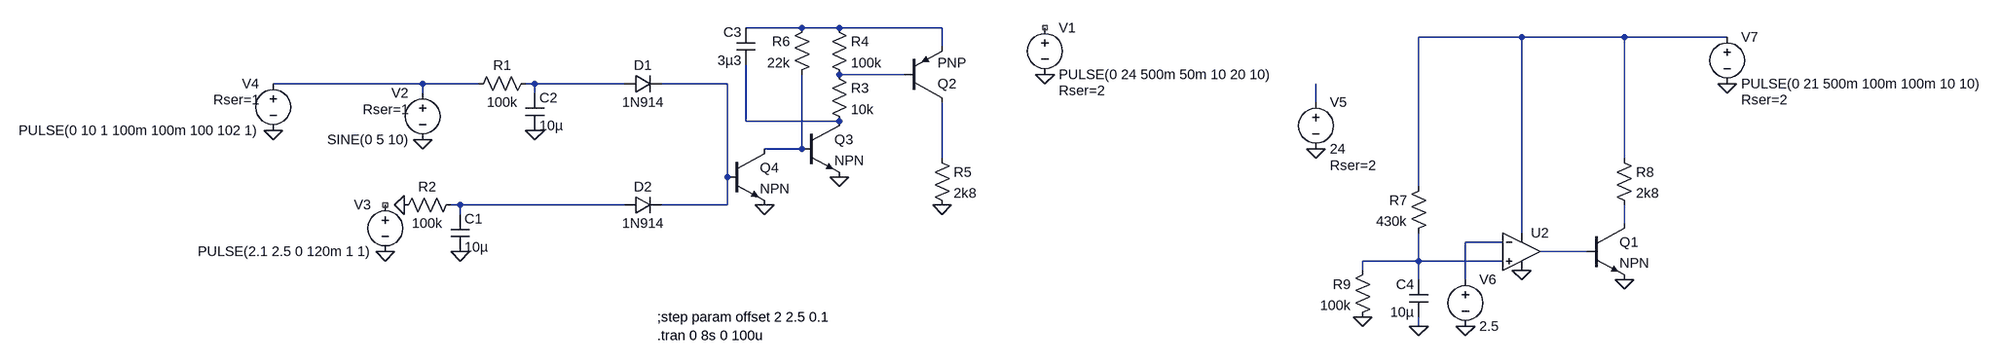
[diagram p0: schematic DC_detection_3.asc]
DC_detection_3.asc, the LTspice schematic file:
Version 4
SHEET 1 2336 680
WIRE 288 -208 192 -208
WIRE 352 -208 288 -208
WIRE 528 -208 352 -208
WIRE 1520 -192 1344 -192
WIRE 1696 -192 1520 -192
WIRE 1872 -192 1696 -192
WIRE 528 -176 528 -208
WIRE 464 -128 352 -128
WIRE -368 -112 -624 -112
WIRE -272 -112 -368 -112
WIRE -176 -112 -192 -112
WIRE -16 -112 -176 -112
WIRE 160 -112 48 -112
WIRE -368 -96 -368 -112
WIRE -176 -96 -176 -112
WIRE 1168 -80 1168 -112
WIRE 192 -48 192 -144
WIRE 352 -48 192 -48
WIRE 288 0 288 -128
WIRE 288 0 224 0
WIRE 528 16 528 -80
WIRE 1696 16 1696 -192
WIRE 160 48 160 -112
WIRE 1344 64 1344 -192
WIRE -304 96 -320 96
WIRE -16 96 -304 96
WIRE 160 96 160 48
WIRE 160 96 48 96
WIRE -304 112 -304 96
WIRE 1696 128 1696 96
WIRE 1520 144 1520 -192
WIRE 1488 160 1424 160
WIRE 1632 176 1552 176
WIRE 1344 192 1344 144
WIRE 1344 192 1248 192
WIRE 1488 192 1344 192
WIRE 1248 208 1248 192
WIRE 1344 224 1344 192
WIRE 1424 224 1424 160
WIRE 1344 304 1344 288
FLAG -176 -32 0
FLAG -304 176 0
FLAG -432 176 0
FLAG -368 -16 0
FLAG 704 -128 0
FLAG 528 96 0
FLAG 224 96 0
FLAG 352 48 0
FLAG -400 96 0
FLAG -624 -32 0
FLAG 1344 304 0
FLAG 1520 208 0
FLAG 1696 224 0
FLAG 1424 304 0
FLAG 1248 288 0
FLAG 1872 -112 0
FLAG 1168 0 0
SYMBOL res -176 -128 R90
WINDOW 0 0 56 VBottom 2
WINDOW 3 32 56 VTop 2
SYMATTR InstName R1
SYMATTR Value 100k
SYMBOL res -304 80 R90
WINDOW 0 0 56 VBottom 2
WINDOW 3 32 56 VTop 2
SYMATTR InstName R2
SYMATTR Value 100k
SYMBOL cap -320 112 R0
SYMATTR InstName C1
SYMATTR Value 10µ
SYMBOL cap -192 -96 R0
SYMATTR InstName C2
SYMATTR Value 10µ
SYMBOL pnp 464 -80 M180
SYMATTR InstName Q2
SYMBOL res 336 -144 R0
SYMATTR InstName R3
SYMATTR Value 10k
SYMBOL res 336 -224 R0
SYMATTR InstName R4
SYMATTR Value 100k
SYMBOL voltage 704 -224 R0
WINDOW 123 0 0 Left 0
WINDOW 39 24 124 Left 2
SYMATTR SpiceLine Rser=2
SYMATTR InstName V1
SYMATTR Value PULSE(0 24 500m 50m 10 20 10)
SYMBOL voltage -368 -112 M0
WINDOW 123 0 0 Left 0
WINDOW 39 24 44 Left 2
SYMATTR SpiceLine Rser=1
SYMATTR InstName V2
SYMATTR Value SINE(0 5 10)
SYMBOL voltage -432 80 M0
WINDOW 123 0 0 Left 0
WINDOW 39 0 0 Left 0
SYMATTR InstName V3
SYMATTR Value PULSE(2.1 2.5 0 120m 1 1)
SYMBOL npn 288 -48 R0
SYMATTR InstName Q3
SYMBOL res 512 0 R0
SYMATTR InstName R5
SYMATTR Value 2k8
SYMBOL res 304 -224 M0
SYMATTR InstName R6
SYMATTR Value 22k
SYMBOL npn 160 0 R0
SYMATTR InstName Q4
SYMBOL diode -16 -96 R270
WINDOW 0 32 32 VTop 2
WINDOW 3 0 32 VBottom 2
SYMATTR InstName D1
SYMATTR Value 1N914
SYMBOL diode -16 112 R270
WINDOW 0 32 32 VTop 2
WINDOW 3 0 32 VBottom 2
SYMATTR InstName D2
SYMATTR Value 1N914
SYMBOL cap 208 -208 M0
SYMATTR InstName C3
SYMATTR Value 3µ3
SYMBOL voltage -624 -128 M0
WINDOW 123 0 0 Left 0
WINDOW 39 24 44 Left 2
SYMATTR SpiceLine Rser=1
SYMATTR InstName V4
SYMATTR Value PULSE(0 10 1 100m 100m 100 102 1)
SYMBOL voltage 1168 -96 R0
WINDOW 123 0 0 Left 0
WINDOW 39 24 124 Left 2
SYMATTR SpiceLine Rser=2
SYMATTR InstName V5
SYMATTR Value 24
SYMBOL cap 1360 224 M0
SYMATTR InstName C4
SYMATTR Value 10µ
SYMBOL res 1360 48 M0
SYMATTR InstName R7
SYMATTR Value 430k
SYMBOL res 1680 0 R0
SYMATTR InstName R8
SYMATTR Value 2k8
SYMBOL voltage 1424 208 R0
WINDOW 123 0 0 Left 0
WINDOW 39 0 0 Left 0
SYMATTR InstName V6
SYMATTR Value 2.5
SYMBOL npn 1632 128 R0
SYMATTR InstName Q1
SYMBOL OpAmps\\UniversalOpAmp 1520 176 R0
SYMATTR InstName U2
SYMBOL res 1264 192 M0
SYMATTR InstName R9
SYMATTR Value 100k
SYMBOL voltage 1872 -208 R0
WINDOW 123 0 0 Left 0
WINDOW 39 24 124 Left 2
SYMATTR SpiceLine Rser=2
SYMATTR InstName V7
SYMATTR Value PULSE(0 21 500m 100m 100m 10 10)
TEXT 40 320 Left 2 !.tran 0 8s 0 100u
TEXT 40 288 Left 2 !;step param offset 2 2.5 0.1

The netlist it stands for:
* DC_detection_3.asc
R1 N005 N004 100k
R2 N011 0 100k
C1 N011 0 10µ
C2 N005 0 10µ
Q2 N010 N003 N001 0 PNP
R3 N003 N008 10k
R4 N001 N003 100k
V1 NC_01 0 PULSE(0 24 500m 50m 10 20 10) Rser=2
V2 N004 0 SINE(0 5 10) Rser=1
V3 NC_02 0 PULSE(2.1 2.5 0 120m 1 1)
Q3 N008 N009 0 0 NPN
R5 N010 0 2k8
R6 N001 N009 22k
Q4 N009 N006 0 0 NPN
D1 N005 N006 1N914
D2 N011 N006 1N914
C3 N001 N008 3µ3
V4 N004 0 PULSE(0 10 1 100m 100m 100 102 1) Rser=1
V5 N007 0 24 Rser=2
C4 N015 0 10µ
R7 N002 N015 430k
R8 N002 N012 2k8
V6 N013 0 2.5
Q1 N012 N014 0 0 NPN
XU2 N015 N013 N002 0 N014 level1 Avol=1Meg GBW=10Meg Vos=0 En=0 Enk=0 In=0 Ink=0 Rin=500Meg  ; pins In+ In- V+ V- OUT
R9 N015 0 100k
V7 N002 0 PULSE(0 21 500m 100m 100m 10 10) Rser=2
.model D D
.lib standard.dio
.model NPN NPN
.model PNP PNP
.lib standard.bjt
.tran 0 8s 0 100u
;step param offset 2 2.5 0.1
.lib UniversalOpAmp1.lib
.backanno
.end